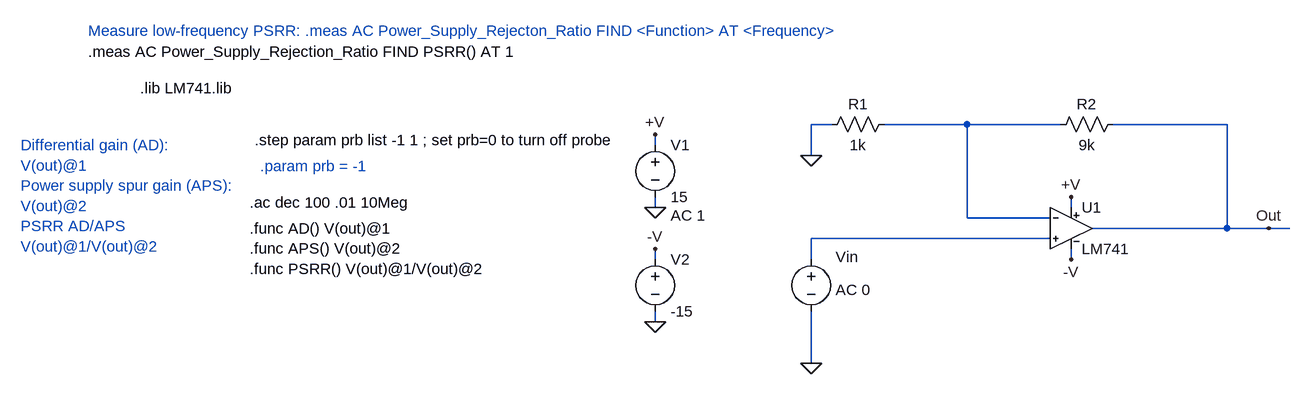
[diagram p0: schematic PSR.asc]
PSR.asc, the LTspice schematic file:
Version 4
SHEET 1 1464 1012
WIRE 160 256 128 256
WIRE 368 256 240 256
WIRE 512 256 368 256
WIRE 768 256 592 256
WIRE -112 288 -112 272
WIRE 128 304 128 256
WIRE -112 384 -112 368
WIRE 528 384 528 368
WIRE 368 400 368 256
WIRE 496 400 368 400
WIRE 768 416 768 256
WIRE 768 416 560 416
WIRE 832 416 768 416
WIRE 864 416 832 416
WIRE 496 432 128 432
WIRE -112 464 -112 448
WIRE 128 464 128 432
WIRE 528 464 528 448
WIRE -112 560 -112 544
WIRE 128 624 128 544
FLAG 128 624 0
FLAG 832 416 Out
FLAG -112 384 0
FLAG -112 560 0
FLAG -112 272 +V
FLAG -112 448 -V
FLAG 528 368 +V
FLAG 528 464 -V
FLAG 128 304 0
SYMBOL voltage 128 448 R0
WINDOW 123 38 63 Left 2
WINDOW 39 0 0 Left 2
WINDOW 0 38 12 Left 2
WINDOW 3 -188 38 Left 2
SYMATTR Value2 AC 0
SYMATTR InstName Vin
SYMATTR Value ""
SYMBOL res 256 240 R90
WINDOW 0 0 56 VBottom 2
WINDOW 3 32 56 VTop 2
SYMATTR InstName R1
SYMATTR Value 1k
SYMBOL res 608 240 R90
WINDOW 0 0 56 VBottom 2
WINDOW 3 32 56 VTop 2
SYMATTR InstName R2
SYMATTR Value 9k
SYMBOL voltage -112 272 R0
WINDOW 123 24 124 Left 2
WINDOW 39 0 0 Left 2
SYMATTR Value2 AC 1
SYMATTR InstName V1
SYMATTR Value 15
SYMBOL voltage -112 448 R0
WINDOW 123 0 0 Left 2
WINDOW 39 0 0 Left 2
SYMATTR InstName V2
SYMATTR Value -15
SYMBOL LM741 528 352 R0
SYMATTR InstName U1
TEXT -728 280 Left 2 !.step param prb list -1 1 ; set prb=0 to turn off probe
TEXT -736 376 Left 2 !.ac dec 100 .01 10Meg
TEXT -984 144 Left 2 !.meas AC Power_Supply_Rejection_Ratio FIND PSRR() AT 1
TEXT -984 112 Left 2 ;Measure low-frequency PSRR: .meas AC Power_Supply_Rejecton_Ratio FIND <Function> AT <Frequency>
TEXT -720 320 Left 2 ;.param prb = -1
TEXT -1088 288 Left 2 ;Differential gain (AD):\nV(out)@1\nPower supply spur gain (APS):\nV(out)@2\nPSRR AD/APS\nV(out)@1/V(out)@2
TEXT -736 416 Left 2 !.func AD() V(out)@1\n.func APS() V(out)@2\n.func PSRR() V(out)@1/V(out)@2
TEXT -904 200 Left 2 !.lib LM741.lib

The netlist it stands for:
* PSR.asc
Vin N002 0 AC 0
R1 N001 0 1k
R2 Out N001 9k
V1 +V 0 15 AC 1
V2 -V 0 -15
XU1 N002 N001 +V -V Out LM741  ; pins In+ In- V+ V- OUT
.step param prb list -1 1 ; set prb=0 to turn off probe
.ac dec 100 .01 10Meg
.meas AC Power_Supply_Rejection_Ratio FIND PSRR() AT 1
* Measure low-frequency PSRR: .meas AC Power_Supply_Rejecton_Ratio FIND <Function> AT <Frequency>
* .param prb = -1
* Differential gain (AD):
* V(out)@1
* Power supply spur gain (APS):
* V(out)@2
* PSRR AD/APS
* V(out)@1/V(out)@2
.func AD() V(out)@1
.func APS() V(out)@2
.func PSRR() V(out)@1/V(out)@2
.lib LM741.lib
.lib LM741.lib
.backanno
.end